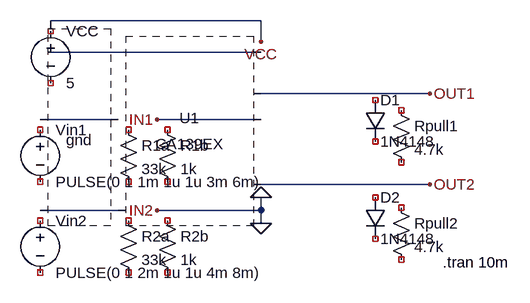
[diagram p0: schematic CA139EX_demo.asc]
CA139EX_demo.asc, the LTspice schematic file:
Version 4
SHEET 1 880 680

SYMBOL voltage 96 48 R0
SYMATTR InstName VCC
SYMATTR Value 5

SYMBOL gnd 96 96 R0

SYMBOL voltage 80 200 R0
SYMATTR InstName Vin1
SYMATTR Value PULSE(0 1 1m 1u 1u 3m 6m)

SYMBOL voltage 80 340 R0
SYMATTR InstName Vin2
SYMATTR Value PULSE(0 1 2m 1u 1u 4m 8m)

* First comparator input network
SYMBOL res 200 200 R0
SYMATTR InstName R1a
SYMATTR Value 33k

SYMBOL res 260 200 R0
SYMATTR InstName R1b
SYMATTR Value 1k

* Second comparator input
SYMBOL res 200 340 R0
SYMATTR InstName R2a
SYMATTR Value 33k

SYMBOL res 260 340 R0
SYMATTR InstName R2b
SYMATTR Value 1k

* Outputs
SYMBOL res 620 170 R0
SYMATTR InstName Rpull1
SYMATTR Value 4.7k

SYMBOL res 620 320 R0
SYMATTR InstName Rpull2
SYMATTR Value 4.7k

* DIODES
SYMBOL diode 580 170 R0
SYMATTR InstName D1
SYMATTR Value 1N4148

SYMBOL diode 580 320 R0
SYMATTR InstName D2
SYMATTR Value 1N4148

* Custom CA139EX part
SYMBOL CA139EX 420 250 R0
SYMATTR InstName U1
SYMATTR Value CA139EX

* Wiring
WIRE 96 48 140 48
WIRE 96 96 140 96
WIRE 140 48 420 48
WIRE 420 48 420 80
WIRE 420 320 420 360
WIRE 140 96 420 96

WIRE 80 200 200 200
WIRE 260 200 420 200

WIRE 80 340 200 340
WIRE 260 340 420 340

* Comparator outputs
WIRE 420 160 580 160
WIRE 580 160 620 160
WIRE 620 160 680 160

WIRE 420 300 580 300
WIRE 580 300 620 300
WIRE 620 300 680 300

* Output nets
FLAG 680 160 OUT1
FLAG 680 300 OUT2

FLAG 420 360 0

* Power
FLAG 420 80 VCC
FLAG 420 320 0

* Input nets
FLAG 260 200 IN1
FLAG 260 340 IN2

* Analysis
TEXT 700 420 Left 0 !.tran 10m

The netlist it stands for:
* CA139EX_demo.asc
VCC NC_01 NC_02 5
* ?: gnd (symbol gnd not available, pin order unknown); nets seen at it: N001, N002, N003, VCC
Vin1 NC_03 NC_04 PULSE(0 1 1m 1u 1u 3m 6m)
Vin2 NC_05 NC_06 PULSE(0 1 2m 1u 1u 4m 8m)
R1a NC_07 NC_08 33k
R1b NC_09 NC_10 1k
R2a NC_11 NC_12 33k
R2b NC_13 NC_14 1k
Rpull1 NC_15 NC_16 4.7k
Rpull2 NC_17 NC_18 4.7k
D1 NC_19 NC_20 1N4148
D2 NC_21 NC_22 1N4148
* U1: CA139EX (symbol CA139EX not available, pin order unknown); nets seen at it: IN1, N001, N003, OUT1, OUT2
.model D D
.lib standard.dio
.tran 10m
.backanno
.end